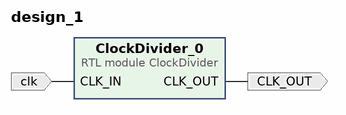
[diagram p0: block diagram of the top level]
# Vivado block design design_1, xc7z020clg400-1, Vivado 2018.3
create_bd_design design_1

create_bd_port -dir I -type clk clk
set_property -dict {CONFIG.FREQ_HZ 125000000} [get_bd_ports clk]
create_bd_port -dir O CLK_OUT

create_bd_cell -type module -reference ClockDivider ClockDivider_0

# ---- connections ----

connect_bd_net [get_bd_ports clk] [get_bd_pins ClockDivider_0/CLK_IN]
connect_bd_net [get_bd_pins ClockDivider_0/CLK_OUT] [get_bd_ports CLK_OUT]

validate_bd_design
save_bd_design
